# EAGLE design Hall Effect Sensor 80mm Internal (EAGLE 7.2.0)
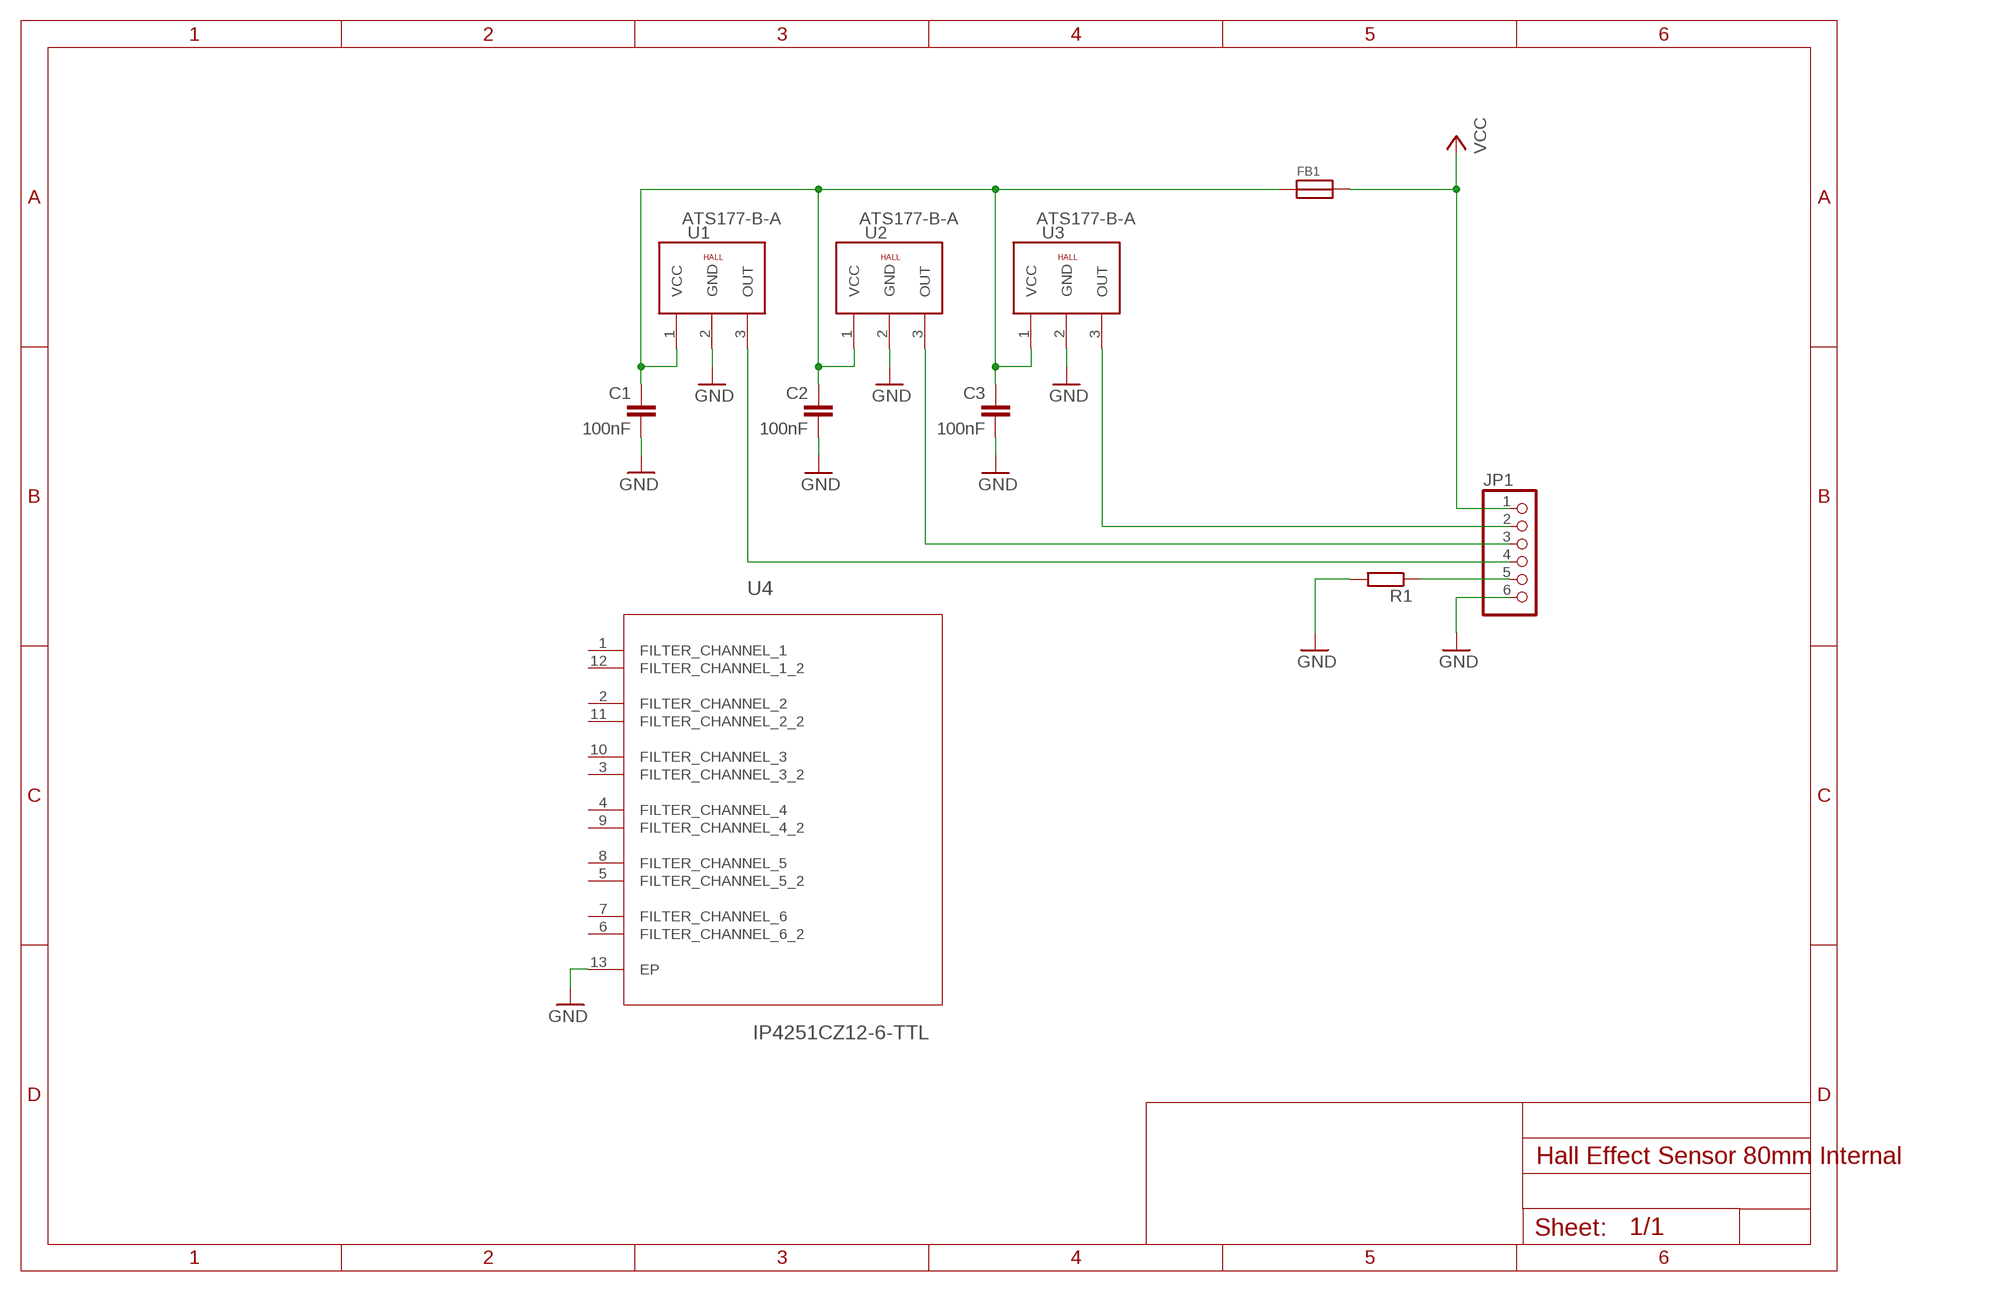
[diagram p0: schematic, sheet 1]

## Parts
C1  100nF  C-EUC0603  [C0603]
C2  100nF  C-EUC0603  [C0603]
C3  100nF  C-EUC0603  [C0603]
FB1  FERRITE  [0603]
JP1  PINHD-1X6  [1X06]
R1  R-EU_R0603  [R0603]
U1  ATS177-B-A  HALL3-SIP  [3PINS1,27]
U2  ATS177-B-A  HALL3-SIP  [3PINS1,27]
U3  ATS177-B-A  HALL3-SIP  [3PINS1,27]
U4  IP4251CZ12-6-TTL  [SON40P135X250X55-13N]

## Nets
GND: C1.2 C2.2 C3.2 JP1.6 R1.2 U1.2(GND) U2.2(GND) U3.2(GND) U4.13(EP)
N$1: JP1.5 R1.1
OUT1: JP1.4 U1.3(OUT)
OUT2: JP1.3 U2.3(OUT)
OUT3: JP1.2 U3.3(OUT)
VCC: FB1.2 JP1.1
VDD: C1.1 C2.1 C3.1 FB1.1 U1.1(VCC) U2.1(VCC) U3.1(VCC)
Unconnected: U4.1(FILTER_CHANNEL_1) U4.2(FILTER_CHANNEL_2) U4.3(FILTER_CHANNEL_3_2) U4.4(FILTER_CHANNEL_4) U4.5(FILTER_CHANNEL_5_2) U4.6(FILTER_CHANNEL_6_2) U4.7(FILTER_CHANNEL_6) U4.8(FILTER_CHANNEL_5) U4.9(FILTER_CHANNEL_4_2) U4.10(FILTER_CHANNEL_3) U4.11(FILTER_CHANNEL_2_2) U4.12(FILTER_CHANNEL_1_2)

## Library data of the parts
C1-C3 = rcl:C-EU: CAPACITOR, European symbol; MF: TDK; MPN: CGA3E2X7R1H104K080AA; OC_FARNELL: 2346967
FB1 = microbuilder:FERRITE: Ferrite Bead 0603 MMZ1608B121C - 120 Ohm, 600mA Ferrite Chip - Digikey: 445-2164-1-ND BK1608HW121-T - 120 Ohm, 600mA Ferrite Chip - Digikey: 587-1876-2-ND; MF: MURATA; MPN: BLM18TG601TN1D; OC_FARNELL: 1115050
JP1 = pinhead:PINHD-1X6: PIN HEADER
R1 = rcl:R-EU_: RESISTOR, European symbol
U1-U3 = charleses_parts_bin:HALL; MF: ALLEGRO MICROSYSTEMS; MPN: A1221LUA-T; OC_FARNELL: 1791408
U4 = NXP_By_element14_Batch_1:IP4251CZ12-6-TTL: Integrated 6- channel passive filter network with ESD protection; MPN: IP4251CZ12-6-TTL; OC_FARNELL: 1972683; OC_NEWARK: 58T9584; PACKAGE: HUSON-12; SUPPLIER: NXP

## Board
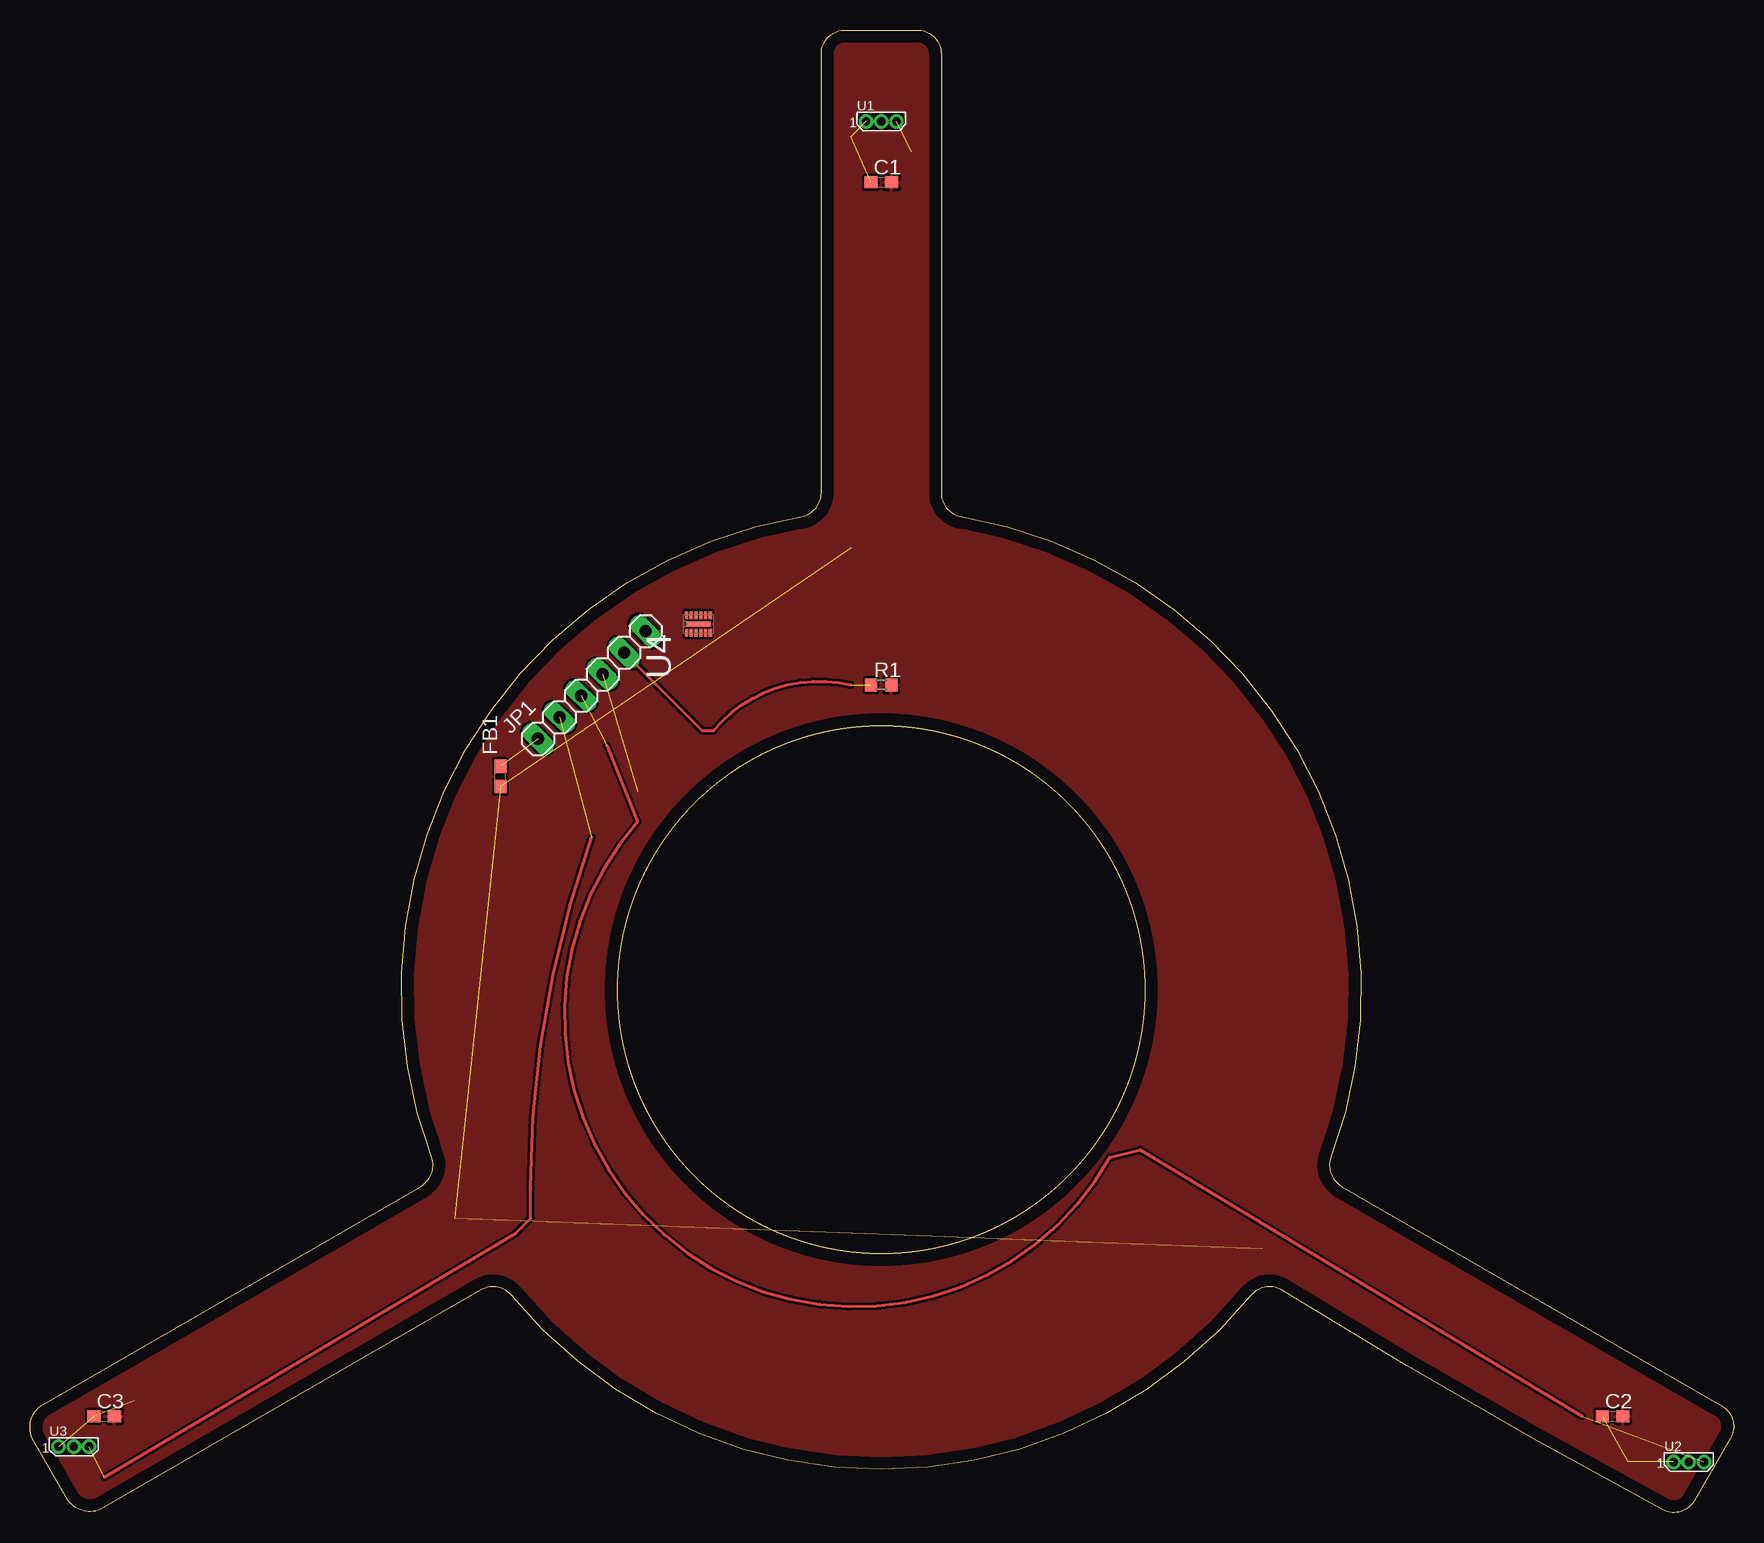
[diagram p1: board, top side]
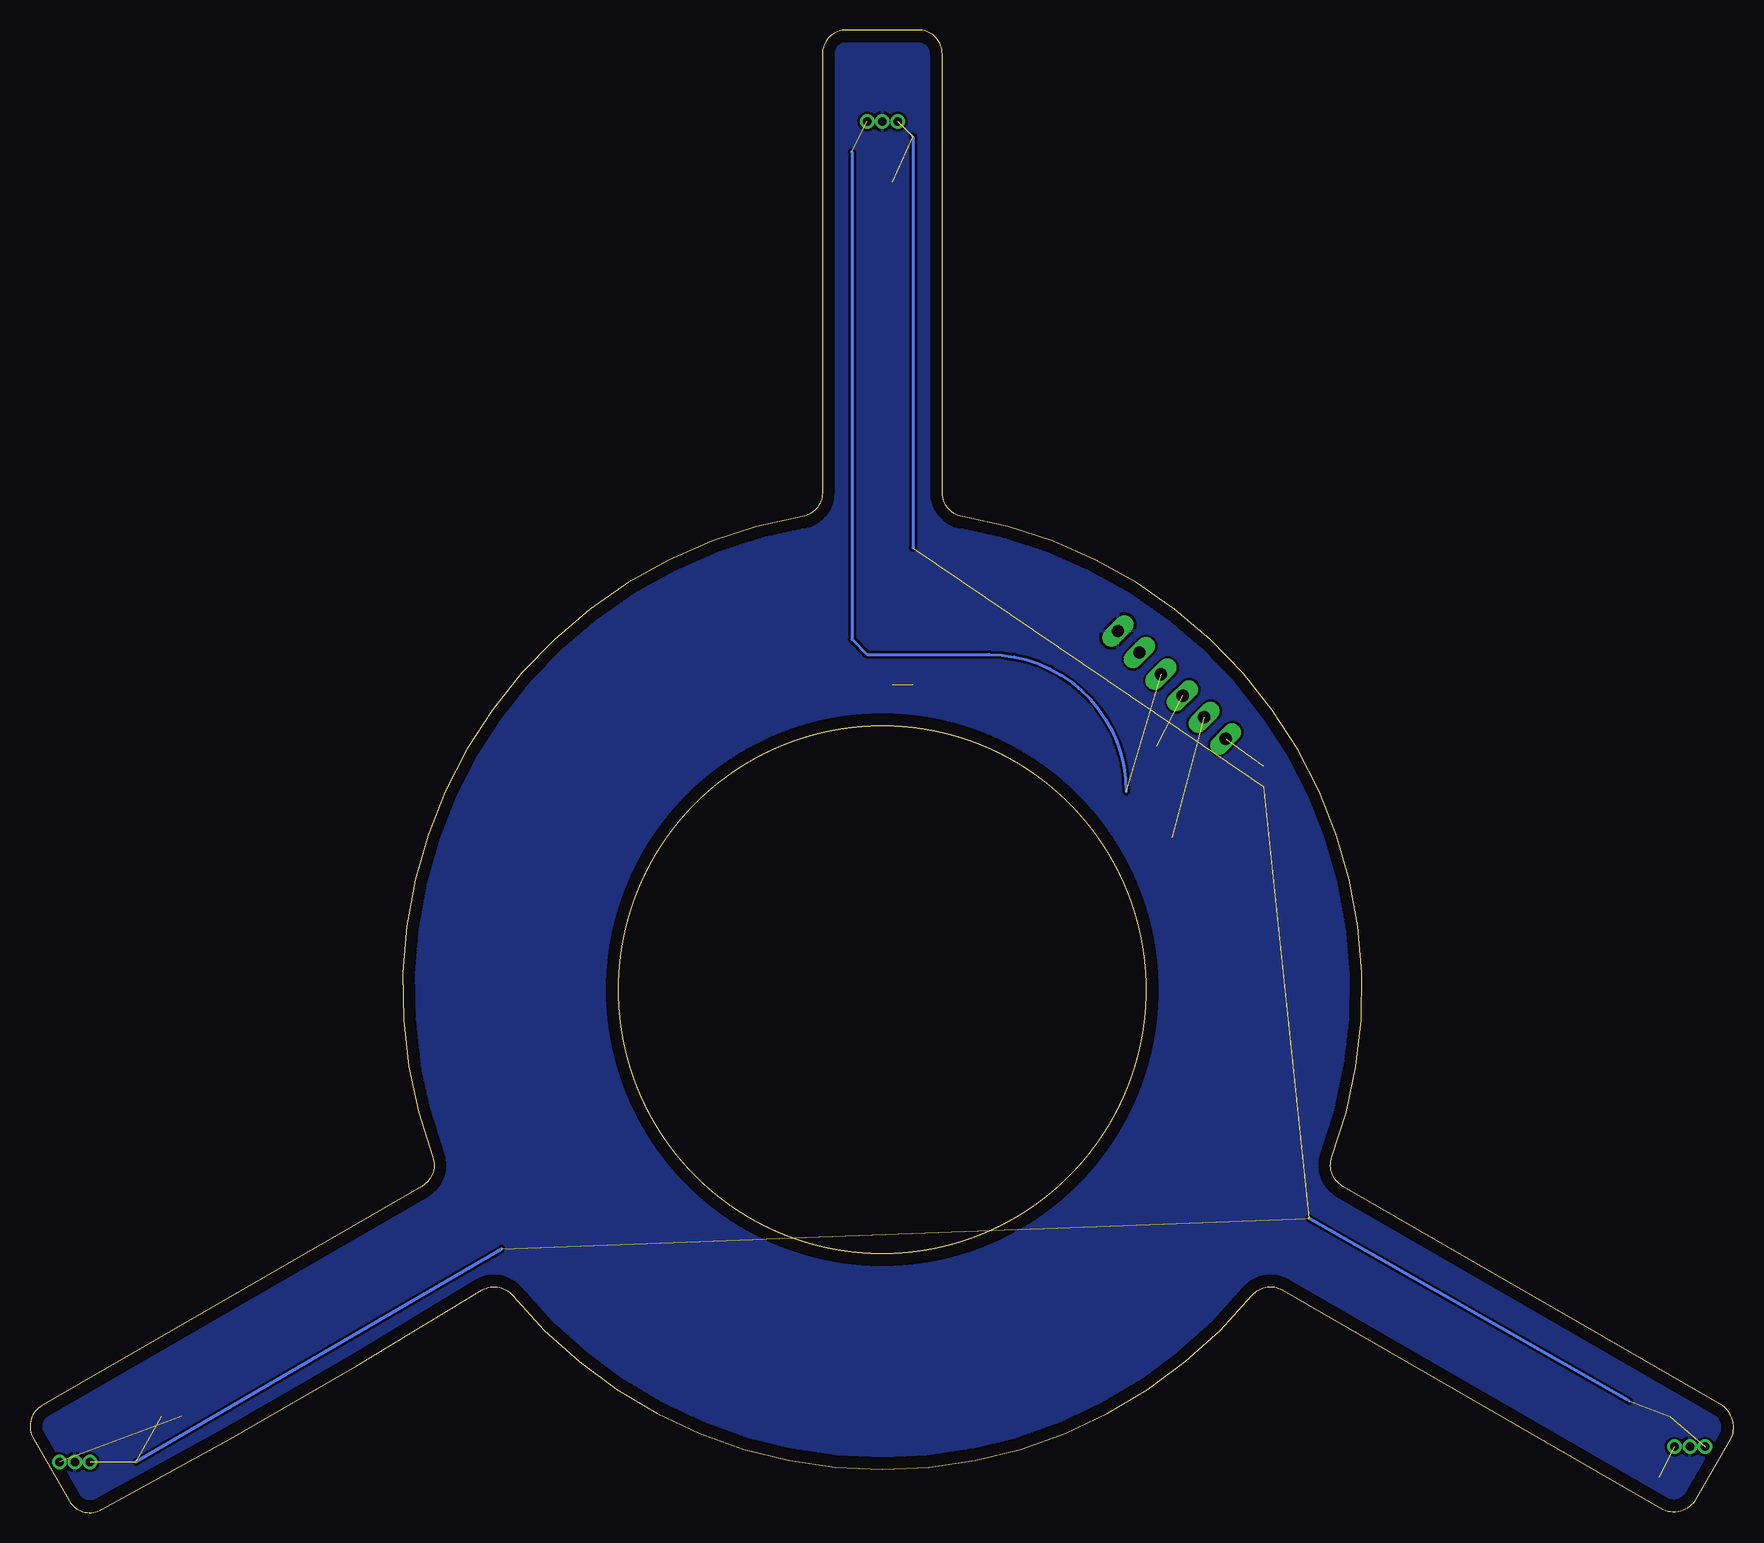
[diagram p2: board, bottom side, seen from below]

Size 142.01 x 123.6 mm. Coordinates in mm from the lower left corner, seen from the top.
Outline: 65.96,85.01 65.96,121.6 arc-90 67.96,123.6 73.96,123.6 arc-90 75.96,121.6 75.96,85.01 arc80 77.63,83.04 arc-101 108.45,29.65 arc80 109.32,27.22 141.01,8.93 arc-90 141.74,6.2 138.74,1 arc-90 136.01,0.27 arc-3 104.32,18.56 arc80 101.78,18.1 arc-101 40.14,18.1 arc80 37.6,18.56 5.91,0.27 arc-75 3.18,1 0.18,6.2 arc-75 0.91,8.93 32.6,27.22 arc80 33.47,29.65 arc-101 64.29,83.04 arc80 65.96,85.01
Outline: circle at 70.96,43.6 radius 22
Copper layers (1*16): Top 0.035mm / dielectric 1.5mm / Bottom 0.035mm
Design rules "default": minimum track width 10mil, minimum drill 24mil, track to track 8mil, track to pad 8mil, pad to pad 8mil, via to via 8mil, smd to smd 8mil, copper to edge 40mil, drill to drill 8mil, minimum pad ring 10mil, minimum via ring 8mil, stop-mask expansion 4mil, vias tented up to drill 0mil, thermal gap 10mil

### Footprints (pad centres in the part's own frame; a part is rotated, then mirrored left to right if it is on the bottom)
C0603 = smd 1.1 x 1: 1 -0.85,0; 2 0.85,0
0603 = smd 1.1 x 1: 1 -0.85,0; 2 0.85,0
1X06 = drill 1.016 long: 1 -6.35,0; 2 -3.81,0; 3 -1.27,0; 4 1.27,0; 5 3.81,0; 6 6.35,0
R0603 = smd 1 x 1.1: 1 -0.85,0; 2 0.85,0
3PINS1,27 = drill 0.7 pad 1.016: 1 -1.27,0; 2 0,0; 3 1.27,0
SON40P135X250X55-13N = smd 0.61 x 0.254: 1 -0.737,0.991; 2 -0.737,0.61; 3 -0.737,0.203; 4 -0.737,-0.203; 5 -0.737,-0.61; 6 -0.737,-0.991; 7 0.737,-0.991; 8 0.737,-0.61; 9 0.737,-0.203; 10 0.737,0.203; 11 0.737,0.61; 12 0.737,0.991 | smd 0.406 x 2.007: 13 0,0

### Placement (x,y rotation side)
C1  70.96,110.91 0 top
C2  131.92,8.04 0 top
C3  6.19,8.04 0 top
FB1  39.21,61.38 90 top
JP1  46.83,69 45 top
R1  70.96,69 0 top
U1  70.96,115.98 0 top
U2  138.27,4.23 0 top
U3  3.65,5.5 0 top
U4  55.72,74.08 90 top

### Tracks (layer width: path | path; a pad name or v marks a point on that pad's centre or on a via)
GND
  pour Bottom (rank 6): 70.96,123.6 arc120 1.68,3.6 arc120 140.24,3.6 arc120
  pour Top (rank 6): 70.96,123.6 arc120 1.68,3.6 arc120 140.24,3.6 arc120
N$1  (1 unrouted)
  Top 0.254: JP1.5 56.03,65.19 56.99,65.19 arc-64 68.42,69
OUT1  (2 unrouted)
  Bottom 0.254: 73.5,113.45 73.5,72.81 72.23,71.54 62.07,71.54 arc90 50.64,60.11
OUT2  (2 unrouted)
  Top 0.254: 48.1,63.92 50.64,57.57 arc192 90.01,29.63 92.55,30.26 129.38,8.04
OUT3  (2 unrouted)
  Top 0.254: 6.19,2.96 40.48,23.28 41.75,24.55 41.75,27.09 arc-20 46.83,56.3
VCC  (1 unrouted)
VDD  (9 unrouted)
  Bottom 0.254: 68.42,114.72 68.42,80.43 | 133.19,4.23 102.71,22.01 | 8.73,9.31 35.4,24.55